# EAGLE design Main_Board (EAGLE 6.0)
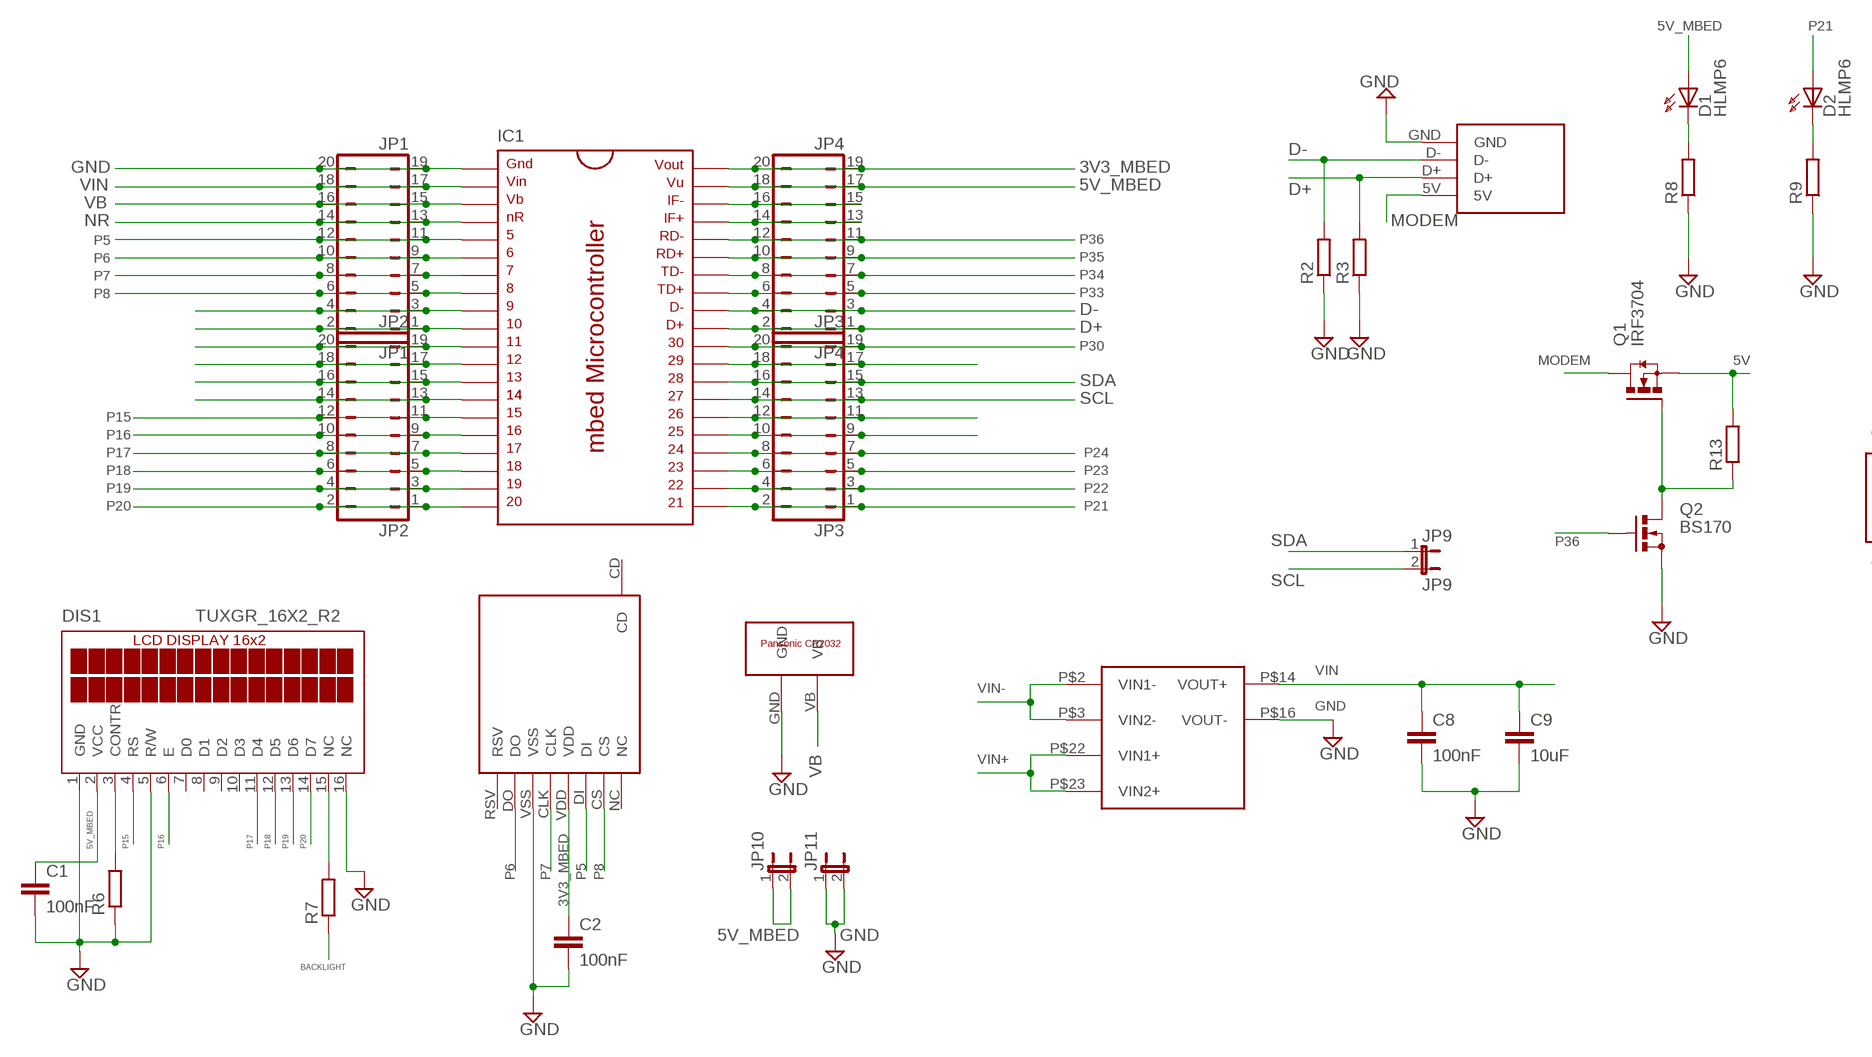
[diagram p0: schematic, sheet 1, part 1 of 2]
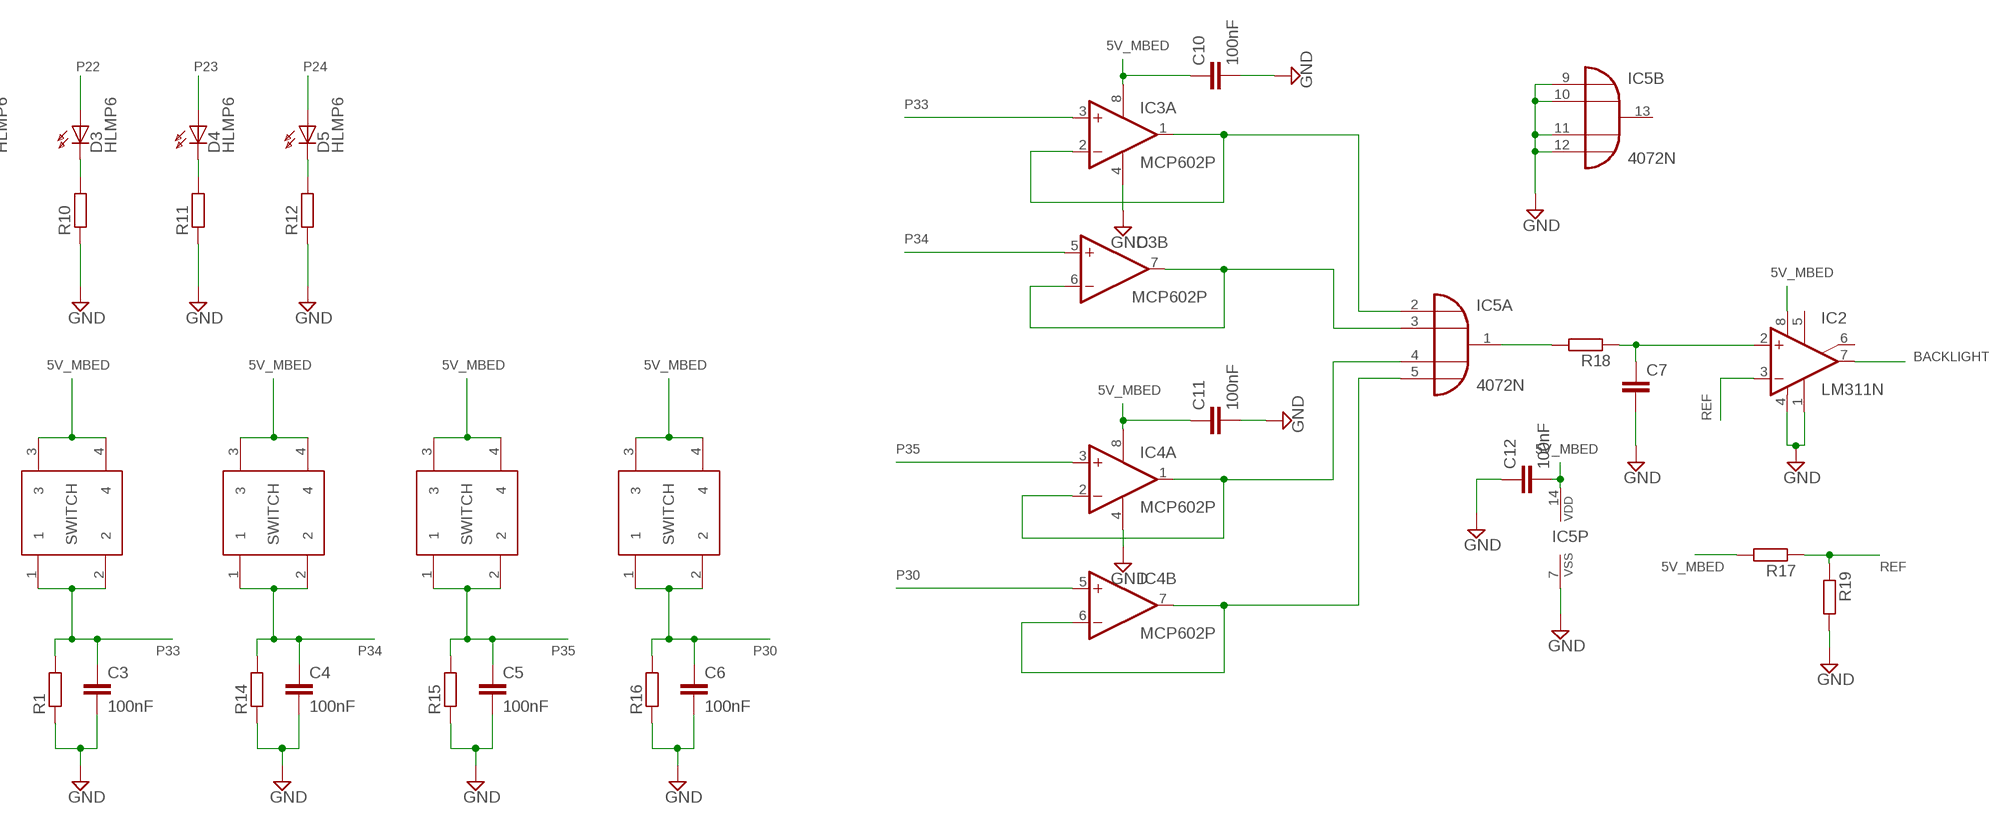
[diagram p1: schematic, sheet 1, part 2 of 2]

## Parts
C1  100nF  C5/3  [C5B3]
C2  100nF  C5/3  [C5B3]
C3  100nF  C5/3  [C5B3]
C4  100nF  C5/3  [C5B3]
C5  100nF  C5/3  [C5B3]
C6  100nF  C5/3  [C5B3]
C7  C5/3  [C5B3]
C8  100nF  C5/3  [C5B3]
C9  10uF  C5/3  [C5B3]
C10  100nF  C5/3  [C5B3]
C11  100nF  C5/3  [C5B3]
C12  100nF  C5/3  [C5B3]
D1  HLMP6  [HLMP6]
D2  HLMP6  [HLMP6]
D3  HLMP6  [HLMP6]
D4  HLMP6  [HLMP6]
D5  HLMP6  [HLMP6]
DIS1  TUXGR_16X2_R2  [TUXGR_16X2_R2]
IC1  MBED_MICROCONTROLLER  [DIL40_0.9]
IC2  LM311N  [DIL08]
IC3  MCP602P  [DIL08]
IC4  MCP602P  [DIL08]
IC5  4072N  [DIL14]
JP1  JP1  JP10Q  [JP10Q]
JP2  JP2  JP10Q  [JP10Q]
JP3  JP3  JP10Q  [JP10Q]
JP4  JP4  JP10Q  [JP10Q]
JP9  JP9  JP1E  [JP1]
JP10  JP1E  [JP1]
JP11  JP1E  [JP1]
POWER_SUPPLY  TRACO_ISOLATED_SUPPLY  [TRACO_ISOLATED_SUPPLY]
Q1  IRF3704  [TO220AH]
Q2  BS170  [SOT54E]
R1  R-EU_0411/12  [0411/12]
R2  R-EU_0411/12  [0411/12]
R3  R-EU_0411/12  [0411/12]
R6  R-EU_0411/12  [0411/12]
R7  R-EU_0411/12  [0411/12]
R8  R-EU_0411/12  [0411/12]
R9  R-EU_0411/12  [0411/12]
R10  R-EU_0411/12  [0411/12]
R11  R-EU_0411/12  [0411/12]
R12  R-EU_0411/12  [0411/12]
R13  R-EU_0411/12  [0411/12]
R14  R-EU_0411/12  [0411/12]
R15  R-EU_0411/12  [0411/12]
R16  R-EU_0411/12  [0411/12]
R17  R-EU_0411/12  [0411/12]
R18  R-EU_0411/12  [0411/12]
R19  R-EU_0411/12  [0411/12]
U$1  USBA_SOCKET  [USBA_SOCKET]
U$2  MICROSD_SOCKET  [MICROSD_SOCKET]
U$3  PANASONIC_CR2032  [PANASONIC_CR2032]
U$5  TACT_SWITCH  [TACT_SWITCH]
U$6  TACT_SWITCH  [TACT_SWITCH]
U$7  TACT_SWITCH  [TACT_SWITCH]
U$8  TACT_SWITCH  [TACT_SWITCH]

## Nets
3V3_MBED: C2.1 IC1.40 JP4.19 JP4.20 U$2.VDD
5V: Q1.E(S) R13.2
5V_MBED: C1.1 C10.1 C11.1 C12.2 D1.A DIS1.2(VCC) IC1.39 IC2.8(V+) IC3.8(P:V+) IC4.8(P:V+) IC5.14(P:VDD) JP4.17 JP4.18 JP10.1 JP10.2 R17.2 U$5.3 U$5.4 U$6.3 U$6.4 U$7.3 U$7.4 U$8.3 U$8.4
BACKLIGHT: IC2.7(OUT) R7.1
D+: IC1.31 JP4.1 JP4.2 R3.2 U$1.D+
D-: IC1.32 JP4.3 JP4.4 R2.2 U$1.D-
GND: C1.2 C2.2 C3.2 C4.2 C5.2 C6.2 C7.2 C8.2 C9.2 C10.2 C11.2 C12.1 DIS1.1(GND) DIS1.5(R/W) DIS1.16(NC) IC1.1 IC2.1(GND) IC2.4(V-) IC3.4(P:V-) IC4.4(P:V-) IC5.7(P:VSS) IC5.9(B:I0) IC5.10(B:I1) IC5.11(B:I2) IC5.12(B:I3) JP1.19 JP1.20 JP11.1 JP11.2 POWER_SUPPLY.P$16(VOUT-) Q2.S R1.1 R2.1 R3.1 R6.1 R8.1 R9.1 R10.1 R11.1 R12.1 R14.1 R15.1 R16.1 R19.2 U$1.GND U$2.VSS U$3.GND
MODEM: Q1.C(D) U$1.5V
N$1: D1.K R8.2
N$3: DIS1.3(CONTR) R6.2
N$4: D2.K R9.2
N$5: Q1.B(G) Q2.D R13.1
N$6: IC3.1(A:OUT) IC3.2(A:-IN) IC5.2(A:I0)
N$7: IC3.6(B:-IN) IC3.7(B:OUT) IC5.3(A:I1)
N$8: IC4.1(A:OUT) IC4.2(A:-IN) IC5.4(A:I2)
N$9: IC1.9 JP1.3 JP1.4
N$10: IC1.10 JP1.1 JP1.2
N$11: IC1.11 JP2.19 JP2.20
N$12: IC1.12 JP2.17 JP2.18
N$13: IC1.13 JP2.15 JP2.16
N$14: IC1.14 JP2.13 JP2.14
N$15: D3.K R10.2
N$16: D4.K R11.2
N$17: D5.K R12.2
N$18: IC4.6(B:-IN) IC4.7(B:OUT) IC5.5(A:I3)
N$19: C7.1 IC2.2(+IN) R18.1
N$20: IC5.1(A:O) R18.2
N$23: IC1.38 JP4.15 JP4.16
N$24: IC1.37 JP4.13 JP4.14
N$32: IC1.29 JP3.17 JP3.18
N$35: IC1.26 JP3.11 JP3.12
N$36: IC1.25 JP3.9 JP3.10
N$45: DIS1.15(NC) R7.2
NR: IC1.4 JP1.13 JP1.14
P5: IC1.5 JP1.11 JP1.12 U$2.DI
P6: IC1.6 JP1.9 JP1.10 U$2.DO
P7: IC1.7 JP1.7 JP1.8 U$2.CLK
P8: IC1.8 JP1.5 JP1.6 U$2.CS
P15: DIS1.4(RS) IC1.15 JP2.11 JP2.12
P16: DIS1.6(E) IC1.16 JP2.9 JP2.10
P17: DIS1.11(D4) IC1.17 JP2.7 JP2.8
P18: DIS1.12(D5) IC1.18 JP2.5 JP2.6
P19: DIS1.13(D6) IC1.19 JP2.3 JP2.4
P20: DIS1.14(D7) IC1.20 JP2.1 JP2.2
P21: D2.A IC1.21 JP3.1 JP3.2
P22: D3.A IC1.22 JP3.3 JP3.4
P23: D4.A IC1.23 JP3.5 JP3.6
P24: D5.A IC1.24 JP3.7 JP3.8
P30: C6.1 IC1.30 IC4.5(B:+IN) JP3.19 JP3.20 R16.2 U$8.1 U$8.2
P33: C3.1 IC1.33 IC3.3(A:+IN) JP4.5 JP4.6 R1.2 U$5.1 U$5.2
P34: C4.1 IC1.34 IC3.5(B:+IN) JP4.7 JP4.8 R14.2 U$6.1 U$6.2
P35: C5.1 IC1.35 IC4.3(A:+IN) JP4.9 JP4.10 R15.2 U$7.1 U$7.2
P36: IC1.36 JP4.11 JP4.12 Q2.G
REF: IC2.3(-IN) R17.1 R19.1
SCL: IC1.27 JP3.13 JP3.14 JP9.2
SDA: IC1.28 JP3.15 JP3.16 JP9.1
VB: IC1.3 JP1.15 JP1.16 U$3.VB
VIN: C8.1 C9.1 IC1.2 JP1.17 JP1.18 POWER_SUPPLY.P$14(VOUT+)
VIN+: POWER_SUPPLY.P$22(VIN1+) POWER_SUPPLY.P$23(VIN2+)
VIN-: POWER_SUPPLY.P$2(VIN1-) POWER_SUPPLY.P$3(VIN2-)
Unconnected: DIS1.7(D0) DIS1.8(D1) DIS1.9(D2) DIS1.10(D3) IC2.5(ON) IC2.6(ON/STR) IC5.13(B:O) U$2.CD U$2.NC U$2.RSV

## Library data of the parts
C1-C12 = capacitor-wima:C: CAPACITOR naming: grid - package width
D1-D5 = display-hp:HLMP6: LED 2mm horizontal; MF: AGILENT TECHNOLOGIES; MPN: HLMP-6500; OC_FARNELL: 1652490; OC_NEWARK: 40K0088
DIS1 = display-lcd:TUXGR_16X2_R2: Tuxgraphics LCD display 16x2 characters reflective, without background light Source: tuxgr_12x2_r2.pdf; OC_FARNELL: unknown; OC_NEWARK: unknown
IC1 = mbed-microcontroller:MBED_MICROCONTROLLER: mbed Microcontroller, DIP40, 0.9"
IC2 = linear:LM311: COMPARATOR
IC3 IC4 = linear:MCP602: Single Op Amp 2.7V to 6.0V Single Supply CMOS Source: http://ww1.microchip.com/downloads/en/DeviceDoc/21314g.pdf
IC5 = 40xx:4072: Dual 4-input OR
JP1-JP4 = jumper:JP10Q: JUMPER
JP9-JP11 = jumper:JP1E: JUMPER
POWER_SUPPLY = ekohub2013:TRACO_ISOLATED_SUPPLY
Q1 = transistor-power:IRF3704: SMPS MOSFET HEXFET® Power MOSFET Source: http://www.irf.com/product-info/datasheets/data/irf3704.pdf
Q2 = transistor-small-signal:BS170: N-CHANNEL MOS FET
R1-R3 R6-R19 = rcl:R-EU_: RESISTOR, European symbol
U$1 = ekohub2013:USBA_SOCKET
U$2 = ekohub2013:MICROSD_SOCKET
U$3 = Datalogging_Custom_Parts:PANASONIC_CR2032
U$5-U$8 = ekohub2013:TACT_SWITCH

## Board
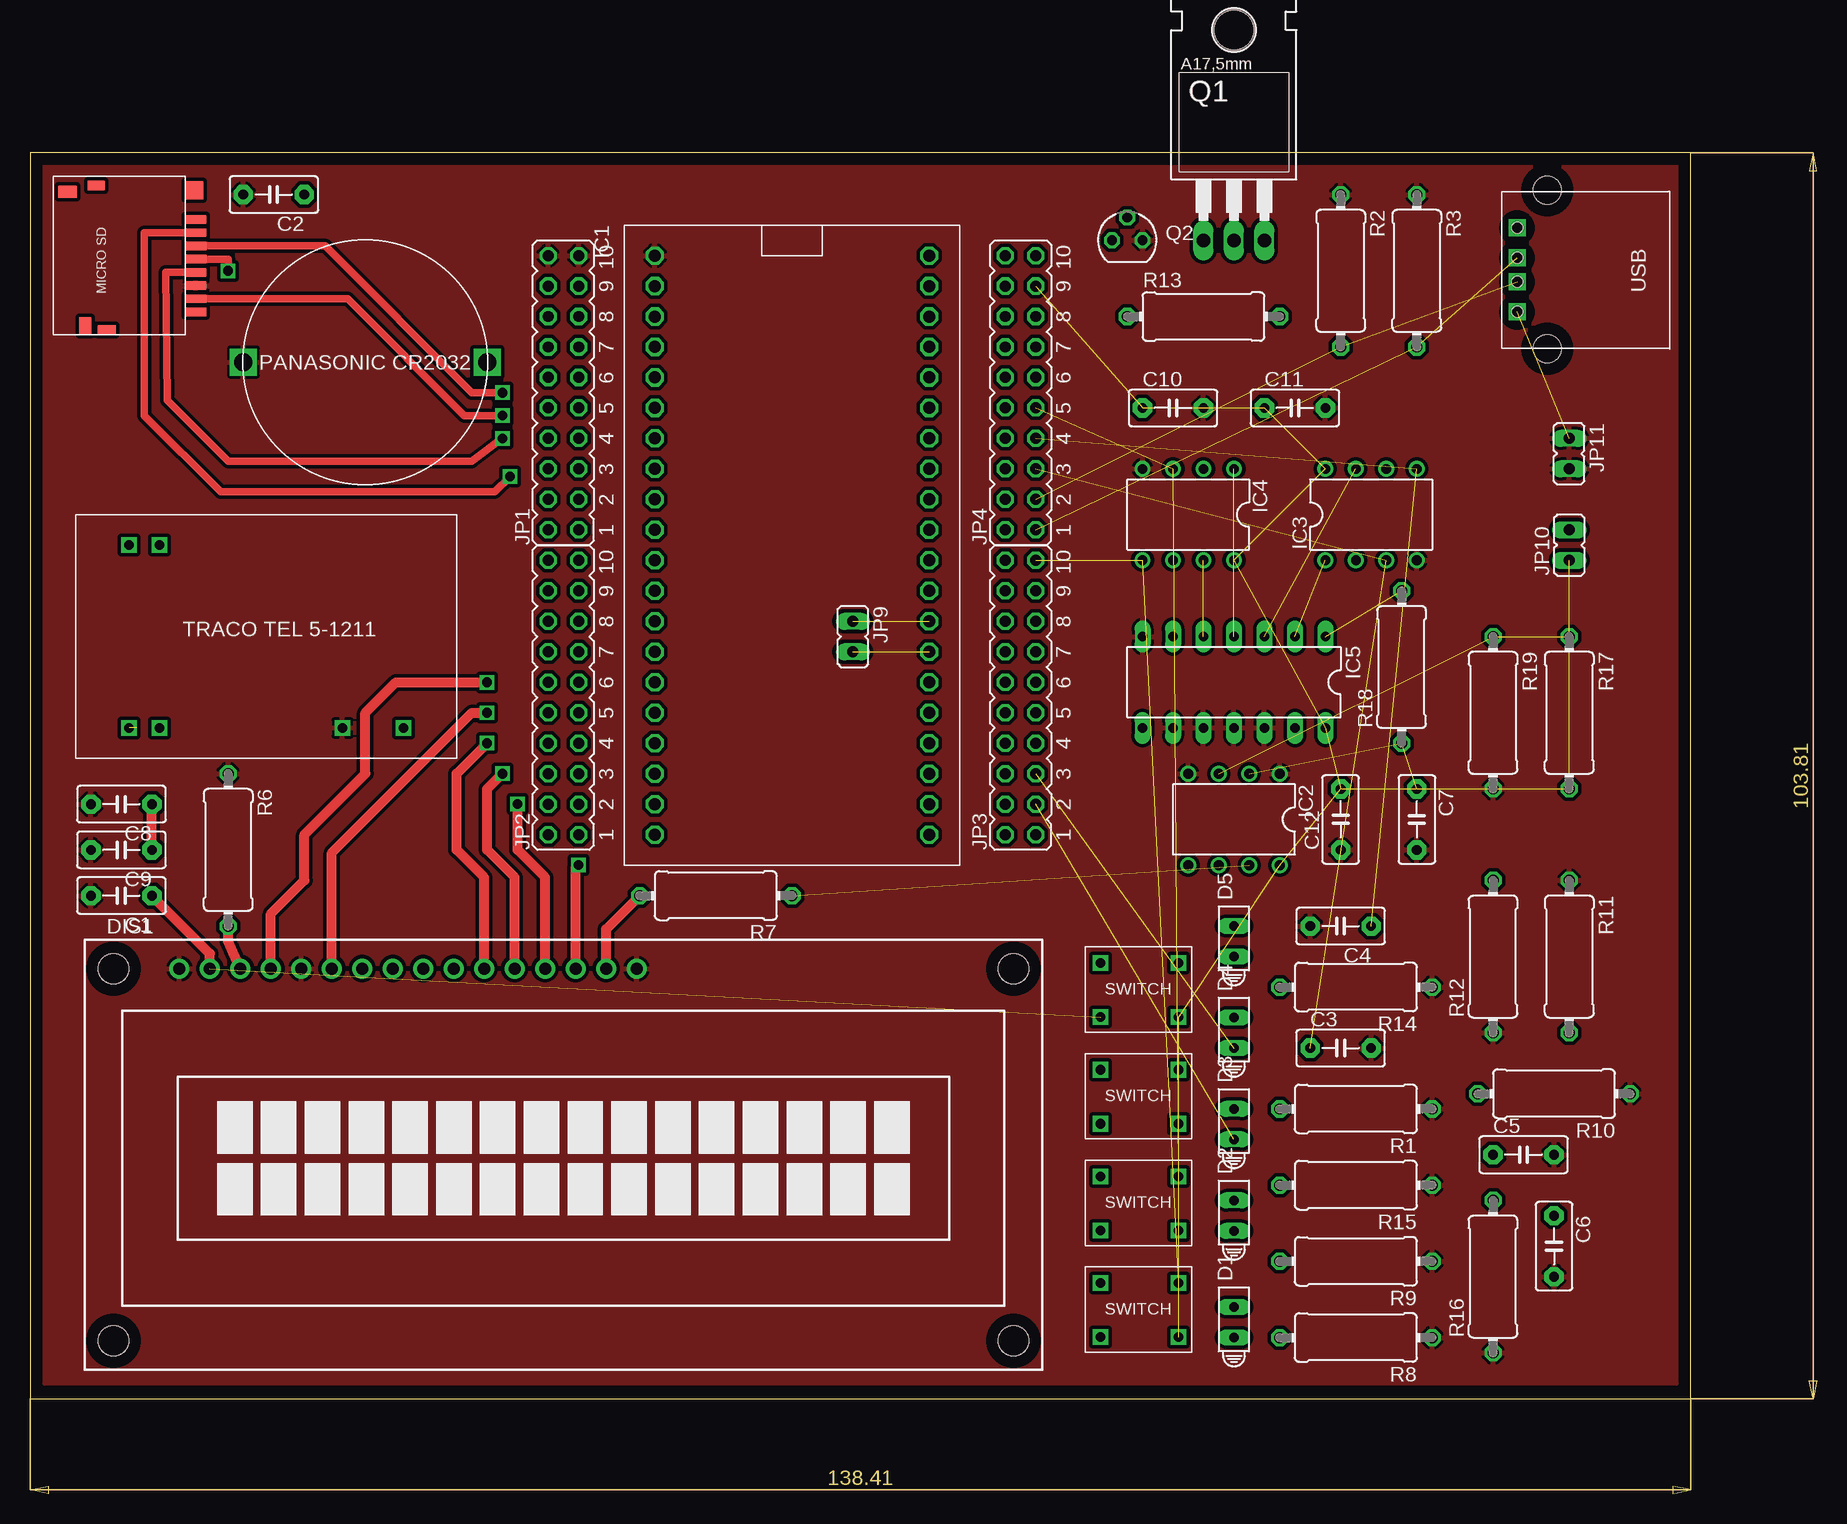
[diagram p2: board, top side]
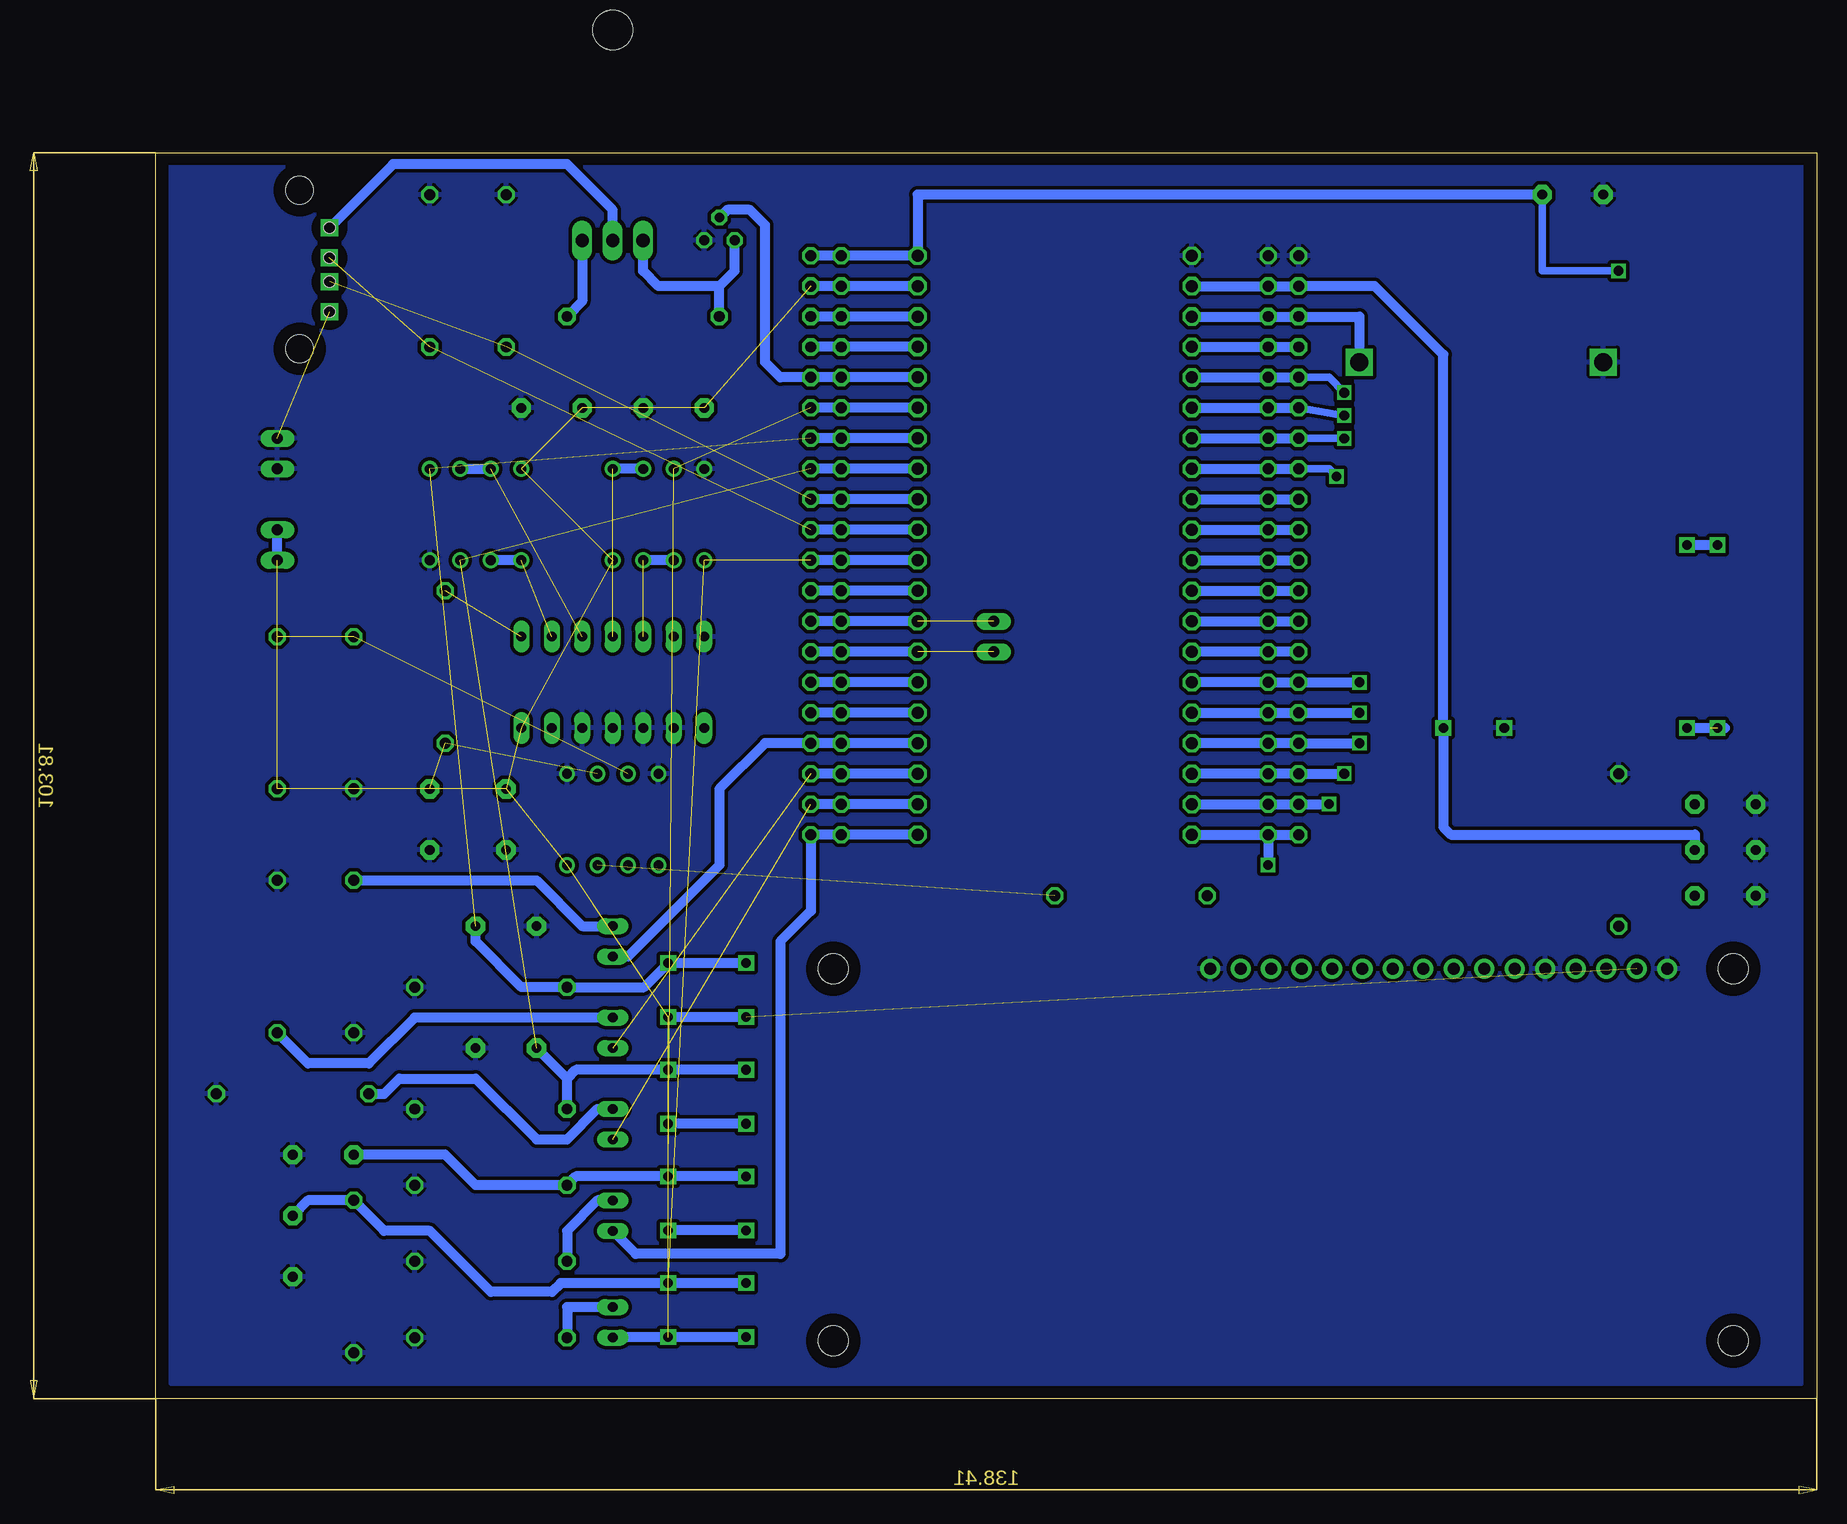
[diagram p3: board, bottom side, seen from below]

Size 138.41 x 103.81 mm. Coordinates in mm from the lower left corner, seen from the top.
Outline: 0,0 138.41,0 138.41,103.81 0,103.81 0,0
Copper layers (1*16): Top 0.035mm / dielectric 1.5mm / Bottom 0.035mm
Design rules: minimum track width 10mil, minimum drill 24mil, track to track 12mil, track to pad 12mil, pad to pad 12mil, via to via 12mil, smd to smd 12mil, copper to edge 40mil, drill to drill 8mil, minimum pad ring 10mil, minimum via ring 8mil, stop-mask expansion 4mil, vias tented up to drill 0mil, thermal gap 10mil

### Footprints (pad centres in the part's own frame; a part is rotated, then mirrored left to right if it is on the bottom)
C5B3 = drill 0.813 pad 1.6 octagon: 1 -2.54,0; 2 2.54,0
HLMP6 = drill 0.813 long: A -1.27,0; K 1.27,0
TUXGR_16X2_R2 = drill 1 pad 1.676: 1 -32,15.5; 2 -29.46,15.5; 3 -26.92,15.5; 4 -24.38,15.5; 5 -21.84,15.5; 6 -19.3,15.5; 7 -16.76,15.5; 8 -14.22,15.5; 9 -11.68,15.5; 10 -9.14,15.5; 11 -6.6,15.5; 12 -4.06,15.5; 13 -1.52,15.5; 14 1.02,15.5; 15 3.56,15.5; 16 6.1,15.5 | hole 2.5: -37.5,-15.5; 37.5,-15.5; -37.5,15.5; 37.5,15.5
DIL40_0.9 = drill 1 pad 1.397 octagon: 1 -22.86,-11.43; 2 -20.32,-11.43; 3 -17.78,-11.43; 4 -15.24,-11.43; 5 -12.7,-11.43; 6 -10.16,-11.43; 7 -7.62,-11.43; 8 -5.08,-11.43; 9 -2.54,-11.43; 10 0,-11.43; 11 2.54,-11.43; 12 5.08,-11.43; 13 7.62,-11.43; 14 10.16,-11.43; 15 12.7,-11.43; 16 15.24,-11.43; 17 17.78,-11.43; 18 20.32,-11.43; 19 22.86,-11.43; 20 25.4,-11.43; 21 25.4,11.43; 22 22.86,11.43; 23 20.32,11.43; 24 17.78,11.43; 25 15.24,11.43; 26 12.7,11.43; 27 10.16,11.43; 28 7.62,11.43; 29 5.08,11.43; 30 2.54,11.43; 31 0,11.43; 32 -2.54,11.43; 33 -5.08,11.43; 34 -7.62,11.43; 35 -10.16,11.43; 36 -12.7,11.43; 37 -15.24,11.43; 38 -17.78,11.43; 39 -20.32,11.43; 40 -22.86,11.43
DIL08 = drill 0.813 pad 1.27: 1 -3.81,-3.81; 2 -1.27,-3.81; 3 1.27,-3.81; 4 3.81,-3.81; 5 3.81,3.81; 6 1.27,3.81; 7 -1.27,3.81; 8 -3.81,3.81
DIL14 = drill 0.813 long: 1 -7.62,-3.81; 2 -5.08,-3.81; 3 -2.54,-3.81; 4 0,-3.81; 5 2.54,-3.81; 6 5.08,-3.81; 7 7.62,-3.81; 8 7.62,3.81; 9 5.08,3.81; 10 2.54,3.81; 11 0,3.81; 12 -2.54,3.81; 13 -5.08,3.81; 14 -7.62,3.81
JP10Q = drill 0.914 octagon: 1 -11.43,-1.27; 2 -11.43,1.27; 3 -8.89,-1.27; 4 -8.89,1.27; 5 -6.35,-1.27; 6 -6.35,1.27; 7 -3.81,-1.27; 8 -3.81,1.27; 9 -1.27,-1.27; 10 -1.27,1.27; 11 1.27,-1.27; 12 1.27,1.27; 13 3.81,-1.27; 14 3.81,1.27; 15 6.35,-1.27; 16 6.35,1.27; 17 8.89,-1.27; 18 8.89,1.27; 19 11.43,-1.27; 20 11.43,1.27
JP1 = drill 0.914 long: 1 0,-1.27; 2 0,1.27
TRACO_ISOLATED_SUPPLY = drill 0.8 square: P$2 0.635,15.24; P$3 3.175,15.24; P$14 23.495,0; P$16 18.415,0; P$22 3.175,0; P$23 0.635,0
TO220AH = drill 1.118 long: B -2.54,-6.35; C 0,-6.35; E 2.54,-6.35 | hole 3.302: 0,11.176
SOT54E = drill 0.813 octagon: D -1.27,0; G 0,1.905; S 1.27,0
0411/12 = drill 0.914 octagon: 1 -6.35,0; 2 6.35,0
USBA_SOCKET = drill 0.92 square: 5V 3.58,5.61; D+ 1.08,5.6; D- -0.92,5.61; GND -3.42,5.61 | hole 2.3: -6.5,3.11; 6.7,3.11 | hole 0.92: -3.42,5.61; -0.92,5.61; 1.08,5.61; 3.58,5.61
MICROSD_SOCKET = smd 1.45 x 1: CD -5.875,1.75 | smd 1 x 1.55: CD2 5.3,3.225 | smd 0.7 x 1.75: CLK -1.4,-7.475; CS 1.9,-7.475; DI 0.8,-7.475; DO -3.6,-7.475; NC 3,-7.475; RSV -4.7,-7.475; VDD -0.3,-7.475; VSS -2.5,-7.475 | smd 1.5 x 1.5: MOUNT2 5.45,-7.35 | smd 0.8 x 1.5: MOUNT3 -6.2,-0.05 | smd 0.8 x 1.4: MOUNT4 5.85,0.825
PANASONIC_CR2032 = drill 1.5 square: GND -10.16,0; VB 10.16,0
TACT_SWITCH = drill 0.8 square: 1 -3.5,2; 2 3,2; 3 -3.5,-2.5; 4 3,-2.5

### Placement (x,y rotation side)
C1  7.62,41.91 180 top
C2  20.32,100.33 180 top
C3  109.22,29.21 0 top
C4  109.22,39.37 180 top
C5  124.46,20.32 0 top
C6  127,12.7 270 top
C7  115.57,48.26 270 top
C8  7.62,49.53 180 top
C9  7.62,45.72 180 top
C10  95.25,82.55 0 top
C11  105.41,82.55 0 top
C12  109.22,48.26 90 top
D1  100.33,6.35 90 top
D2  100.33,15.24 90 top
D3  100.33,22.86 90 top
D4  100.33,30.48 90 top
D5  100.33,38.1 90 top
DIS1  44.45,20.32 0 top
IC1  63.5,72.39 270 top
IC2  100.33,48.26 180 top
IC3  111.76,73.66 0 top
IC4  96.52,73.66 180 top
IC5  100.33,59.69 180 top
JP1  44.45,83.82 90 top
JP2  44.45,58.42 90 top
JP3  82.55,58.42 90 top
JP4  82.55,83.82 90 top
JP9  68.58,63.5 180 top
JP10  128.27,71.12 0 top
JP11  128.27,78.74 180 top
POWER_SUPPLY  7.62,55.88 0 top
Q1  100.33,102.87 0 top
Q2  91.44,96.52 0 top
R1  110.49,24.13 180 top
R2  109.22,93.98 270 top
R3  115.57,93.98 270 top
R6  16.51,45.72 270 top
R7  57.15,41.91 180 top
R8  110.49,5.08 180 top
R9  110.49,11.43 180 top
R10  127,25.4 180 top
R11  128.27,36.83 270 top
R12  121.92,36.83 90 top
R13  97.79,90.17 0 top
R14  110.49,34.29 180 top
R15  110.49,17.78 180 top
R16  121.92,10.16 90 top
R17  128.27,57.15 270 top
R18  114.3,60.96 90 top
R19  121.92,57.15 270 top
U$1  129.54,93.98 90 top
U$2  6.35,95.25 90 top
U$3  27.94,86.36 0 top
U$5  92.71,25.4 0 top
U$6  92.71,34.29 0 top
U$7  92.71,16.51 0 top
U$8  92.71,7.62 0 top

### Tracks (layer width: path | path; a pad name or v marks a point on that pad's centre or on a via)
3V3_MBED  (via drill 0.8)
  Top 0.61: U$2.VDD 16.51,94.95 v16.51,93.98
  Bottom 0.61: C2.1 22.86,93.98 v16.51,93.98
  Bottom 0.813: JP4.19 JP4.20 IC1.40 74.93,100.33 C2.1
5V
  Bottom 0.813: Q1.E 102.87,91.44 R13.2
5V_MBED  (14 unrouted)
  Top 0.813: 95.75,5.08 U$8.4 | DIS1.2 14.99,37.08 C1.1
  Bottom 0.813: IC1.39 JP4.18 JP4.17 | JP10.1 JP10.2 | U$6.3 U$6.4 | U$8.3 U$8.4 100.29,5.12 D1.A | U$7.3 U$7.4 | U$5.3 U$5.4
BACKLIGHT  (1 unrouted)
D+  (2 unrouted)
  Bottom 0.813: IC1.31 JP4.2 JP4.1
D-  (2 unrouted)
  Bottom 0.813: IC1.32 JP4.4 JP4.3
GND  (1 unrouted)
  pour Top: 1.27,104.14 137.16,104.14 137.16,1.27 1.27,1.27
  pour Bottom: 137.16,1.27 1.27,1.27 1.27,104.14 137.16,104.14
MODEM
  Bottom 0.813: Q1.C 100.33,99.06 104.14,102.87 118.62,102.87 U$1.5V
N$1
  Bottom 0.813: D1.K 104.14,7.62 R8.2
N$3
  Top 0.813: DIS1.3 16.51,38.1 R6.2
N$4
  Bottom 0.813: D2.K 101.6,16.51 104.14,13.97 R9.2
N$5
  Bottom 0.813: R13.1 91.44,92.71 | 91.44,92.71 90.17,93.98 Q2.D | 91.44,92.71 96.52,92.71 97.79,93.98 Q1.B
N$6  (1 unrouted)
  Bottom 0.813: IC3.1 IC3.2
N$7  (1 unrouted)
  Bottom 0.813: IC3.6 IC3.7
N$8  (1 unrouted)
  Bottom 0.813: IC4.2 IC4.1
N$9
  Bottom 0.813: IC1.9 JP1.3 JP1.4
N$10
  Bottom 0.813: IC1.10 JP1.1 JP1.2
N$11
  Bottom 0.813: IC1.11 JP2.19 JP2.20
N$12
  Bottom 0.813: IC1.12 JP2.17 JP2.18
N$13
  Bottom 0.813: IC1.13 JP2.15 JP2.16
N$14
  Bottom 0.813: IC1.14 JP2.13 JP2.14
N$15
  Bottom 0.813: R10.2 119.38,25.4 118.11,26.67 111.76,26.67 106.68,21.59 104.14,21.59 101.6,24.13 D3.K
N$16
  Bottom 0.813: D4.K 116.84,31.75 120.65,27.94 125.73,27.94 R11.2
N$17
  Bottom 0.813: R12.2 106.68,43.18 102.87,39.37 D5.K
N$18  (1 unrouted)
  Bottom 0.813: IC4.6 IC4.7
N$19  (2 unrouted)
N$20  (1 unrouted)
N$23
  Bottom 0.813: IC1.38 JP4.16 JP4.15
N$24
  Bottom 0.813: IC1.37 JP4.14 JP4.13
N$32
  Bottom 0.813: IC1.29 JP3.18 JP3.17
N$35
  Bottom 0.813: IC1.26 JP3.12 JP3.11
N$36
  Bottom 0.813: IC1.25 JP3.10 JP3.9
N$45
  Top 0.813: DIS1.15 48.01,39.12 R7.2
NR
  Bottom 0.813: IC1.4 JP1.13 JP1.14
P5  (via drill 0.8)
  Top 0.61: U$2.DI 24.6,96.05 36.83,83.82 v39.37,83.82
  Bottom 0.61: JP1.12 40.64,85.09 v39.37,83.82
  Bottom 0.813: IC1.5 JP1.11 JP1.12
P6  (via drill 0.8)
  Top 0.61: U$2.DO 26.46,91.65 36.2,81.91 v39.37,81.91
  Bottom 0.61: JP1.10 v39.37,81.91
  Bottom 0.813: IC1.6 JP1.9 JP1.10
P7  (via drill 0.8)
  Top 0.61: U$2.CLK 11.3,93.85 11.43,83.19 16.51,78.11 36.83,78.11 v39.37,80.01
  Bottom 0.61: JP1.8 v39.37,80.01
  Bottom 0.813: IC1.7 JP1.7 JP1.8
P8  (via drill 0.8)
  Top 0.61: U$2.CS 12.06,97.15 9.53,97.16 9.53,81.91 15.88,75.56 38.73,75.56 v40,76.83
  Bottom 0.61: JP1.6 40.64,77.47 v40,76.83
  Bottom 0.813: IC1.8 JP1.5 JP1.6
P15  (via drill 0.8)
  Top 0.813: DIS1.4 20.07,40.39 22.86,43.18 22.86,46.99 27.94,52.07 27.94,57.15 30.48,59.69 v38.1,59.69
  Bottom 0.813: IC1.15 JP2.11 JP2.12 v38.1,59.69
P16  (via drill 0.8)
  Top 0.813: DIS1.6 25.15,45.47 36.83,57.15 v38.1,57.15
  Bottom 0.813: IC1.16 JP2.9 JP2.10 v38.1,57.15
P17  (via drill 0.8)
  Top 0.813: DIS1.11 37.85,43.43 35.56,45.72 35.56,52.07 v38.1,54.61
  Bottom 0.813: IC1.17 JP2.7 JP2.8 v38.1,54.61
P18  (via drill 0.8)
  Top 0.813: DIS1.12 40.39,43.43 38.1,45.72 38.1,50.8 v39.37,52.07
  Bottom 0.813: IC1.18 JP2.5 JP2.6 v39.37,52.07
P19  (via drill 0.8)
  Top 0.813: DIS1.13 42.93,43.43 40.64,45.72 v40.64,49.53
  Bottom 0.813: IC1.19 JP2.3 JP2.4 v40.64,49.53
P20  (via drill 0.8)
  Top 0.813: DIS1.14 45.47,44.2 v45.72,44.45
  Bottom 0.813: IC1.20 JP2.1 | JP2.1 JP2.2 | JP2.1 v45.72,44.45
P21
  Bottom 0.813: IC1.21 JP3.2 JP3.1 83.82,40.64 86.36,38.1 86.36,12.06 98.42,12.06 D2.A
P22  (1 unrouted)
  Bottom 0.813: IC1.22 JP3.4 JP3.3
P23  (1 unrouted)
  Bottom 0.813: IC1.23 JP3.6 JP3.5
P24
  Bottom 0.813: IC1.24 JP3.8 JP3.7 87.63,54.61 91.44,50.8 91.44,44.45 99.06,36.83 D5.A
P30  (2 unrouted)
  Bottom 0.813: IC1.30 JP3.20 JP3.19 | U$8.1 U$8.2 104.68,9.62 105.41,8.89 110.49,8.89 115.57,13.97 119.38,13.97 R16.2 125.73,16.51 C6.1
P33  (2 unrouted)
  Bottom 0.813: IC1.33 JP4.6 JP4.5 | U$5.1 U$5.2 103.41,27.4 104.14,26.67 | R1.2 104.14,26.67 | 104.14,26.67 C3.1
P34  (2 unrouted)
  Bottom 0.813: IC1.34 JP4.8 JP4.7 | U$6.1 U$6.2 | U$6.2 95.79,36.29 95.89,36.2 | U$6.2 97.71,34.29 R14.2 107.95,34.29 111.76,38.1 C4.1
P35  (2 unrouted)
  Bottom 0.813: IC1.35 JP4.10 JP4.9 | U$7.1 U$7.2 103.41,18.51 R15.2 111.76,17.78 114.3,20.32 C5.1
P36
  Bottom 0.813: IC1.36 JP4.12 JP4.11 86.36,85.09 87.63,86.36 87.63,97.79 88.9,99.06 90.81,99.06 Q2.G
REF  (2 unrouted)
SCL  (1 unrouted)
  Bottom 0.813: IC1.27 JP3.14 JP3.13
SDA  (1 unrouted)
  Bottom 0.813: IC1.28 JP3.16 JP3.15
VB
  Bottom 0.813: IC1.3 JP1.15 JP1.16 38.1,90.17 U$3.VB
VIN
  Top 0.813: C9.1 C8.1
  Bottom 0.813: IC1.2 JP1.17 JP1.18 36.83,92.71 31.11,87 POWER_SUPPLY.P$14 31.11,47.62 30.48,46.99 10.16,46.99 C9.1
VIN+  (1 unrouted)
  Bottom 0.813: POWER_SUPPLY.P$22 8.89,55.88 7.62,55.88
VIN-
  Bottom 0.813: POWER_SUPPLY.P$2 POWER_SUPPLY.P$3